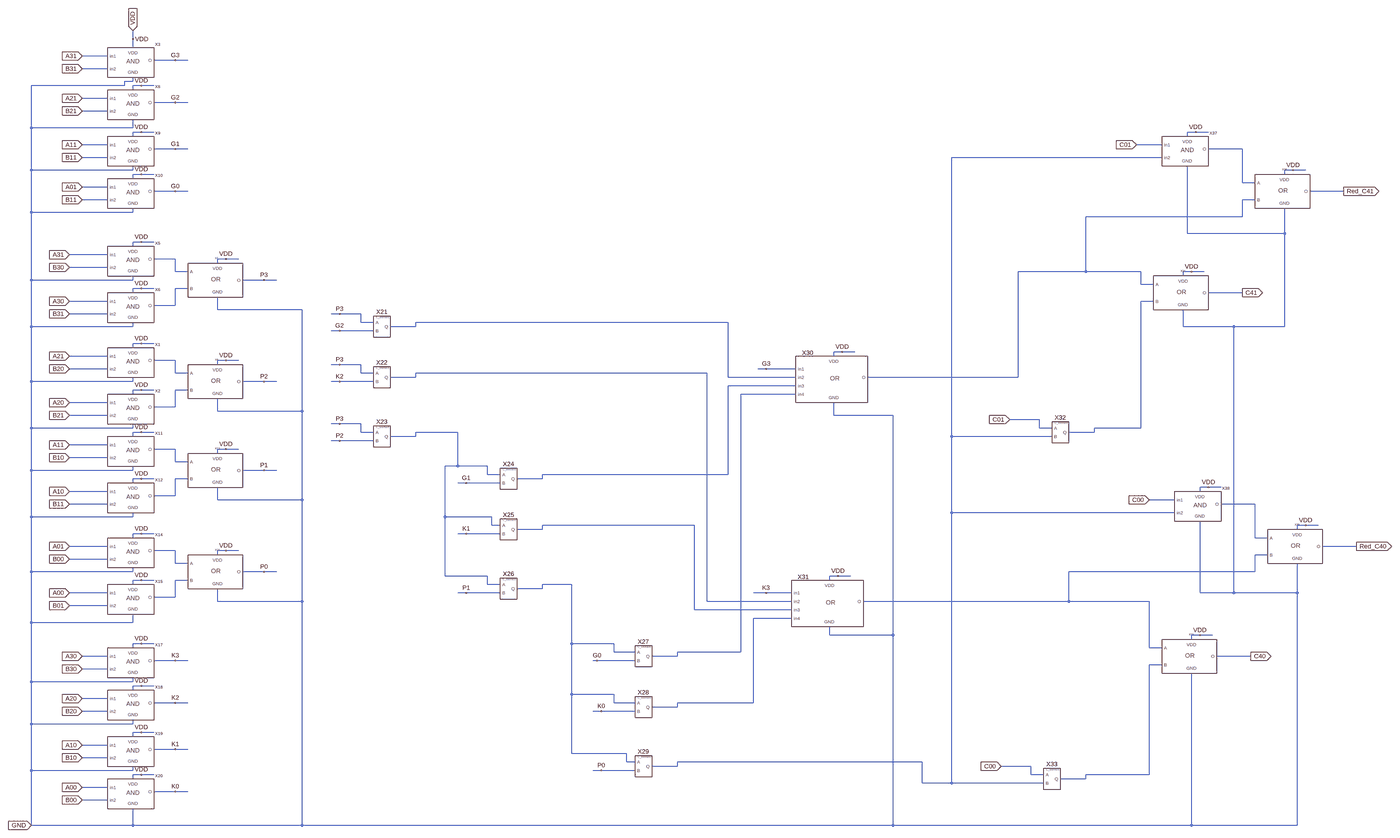
[diagram p0: schematic asy_CLA_4bit.asc, whole sheet]
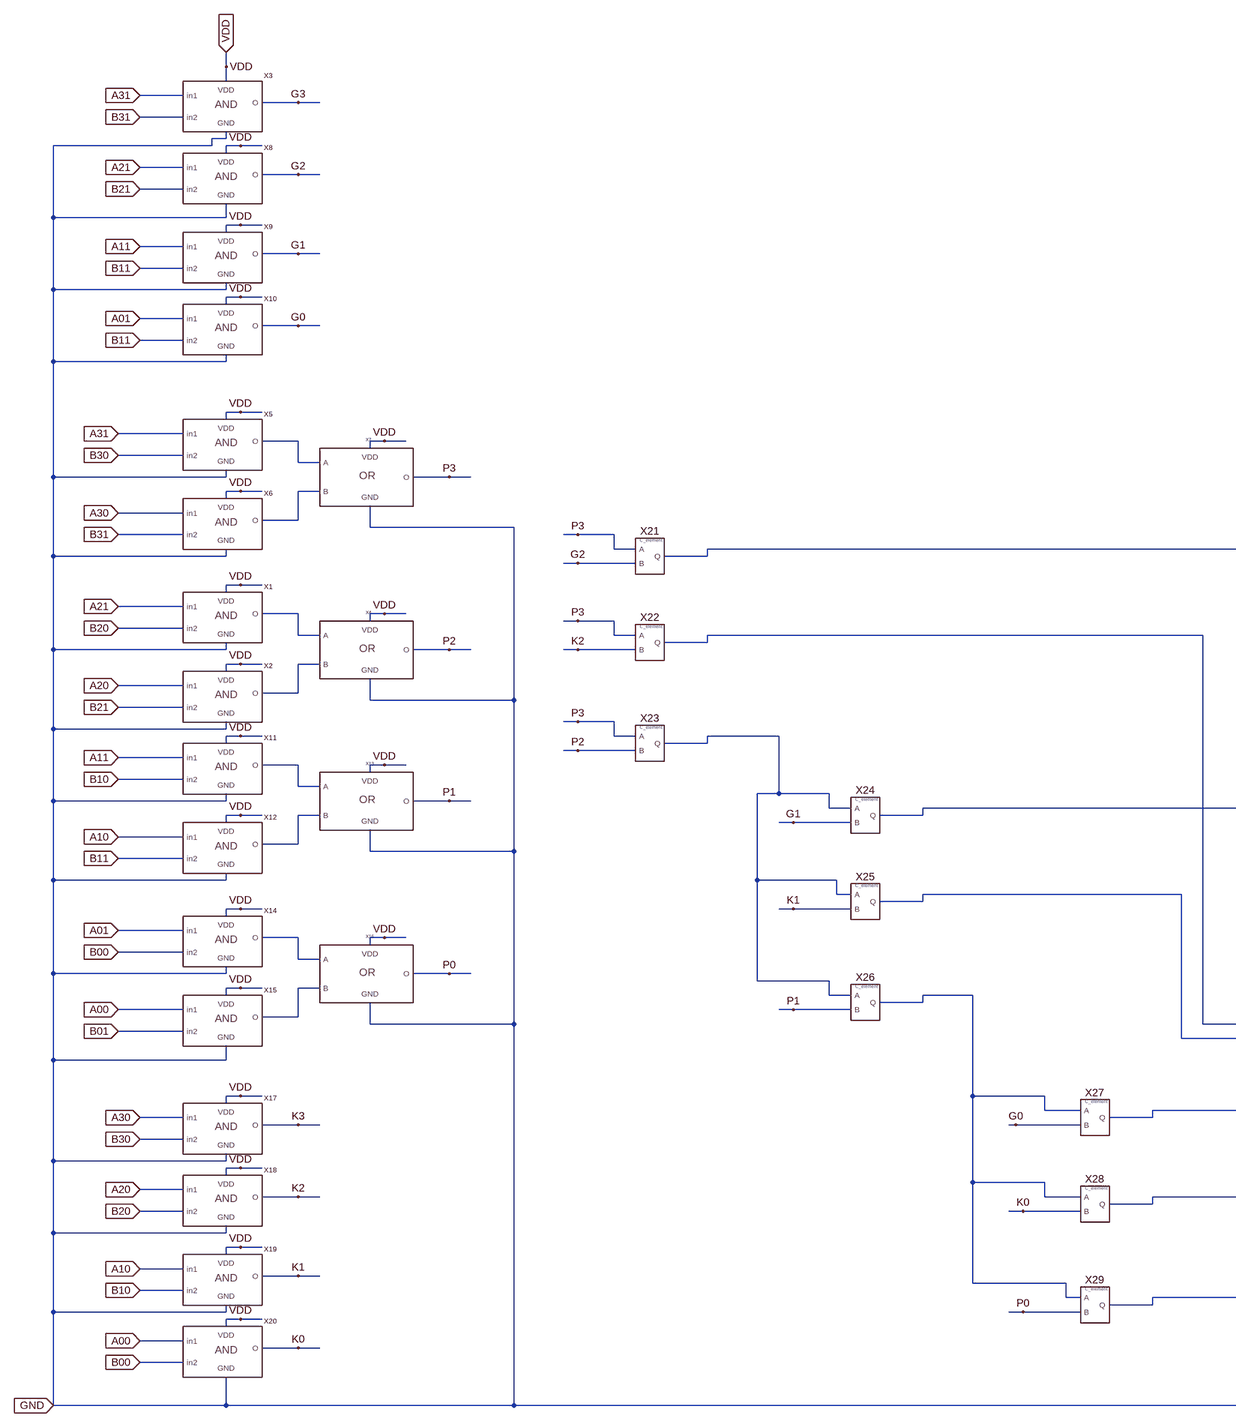
[diagram p1: schematic asy_CLA_4bit.asc, part, row 1 of 1, column 1 of 2]
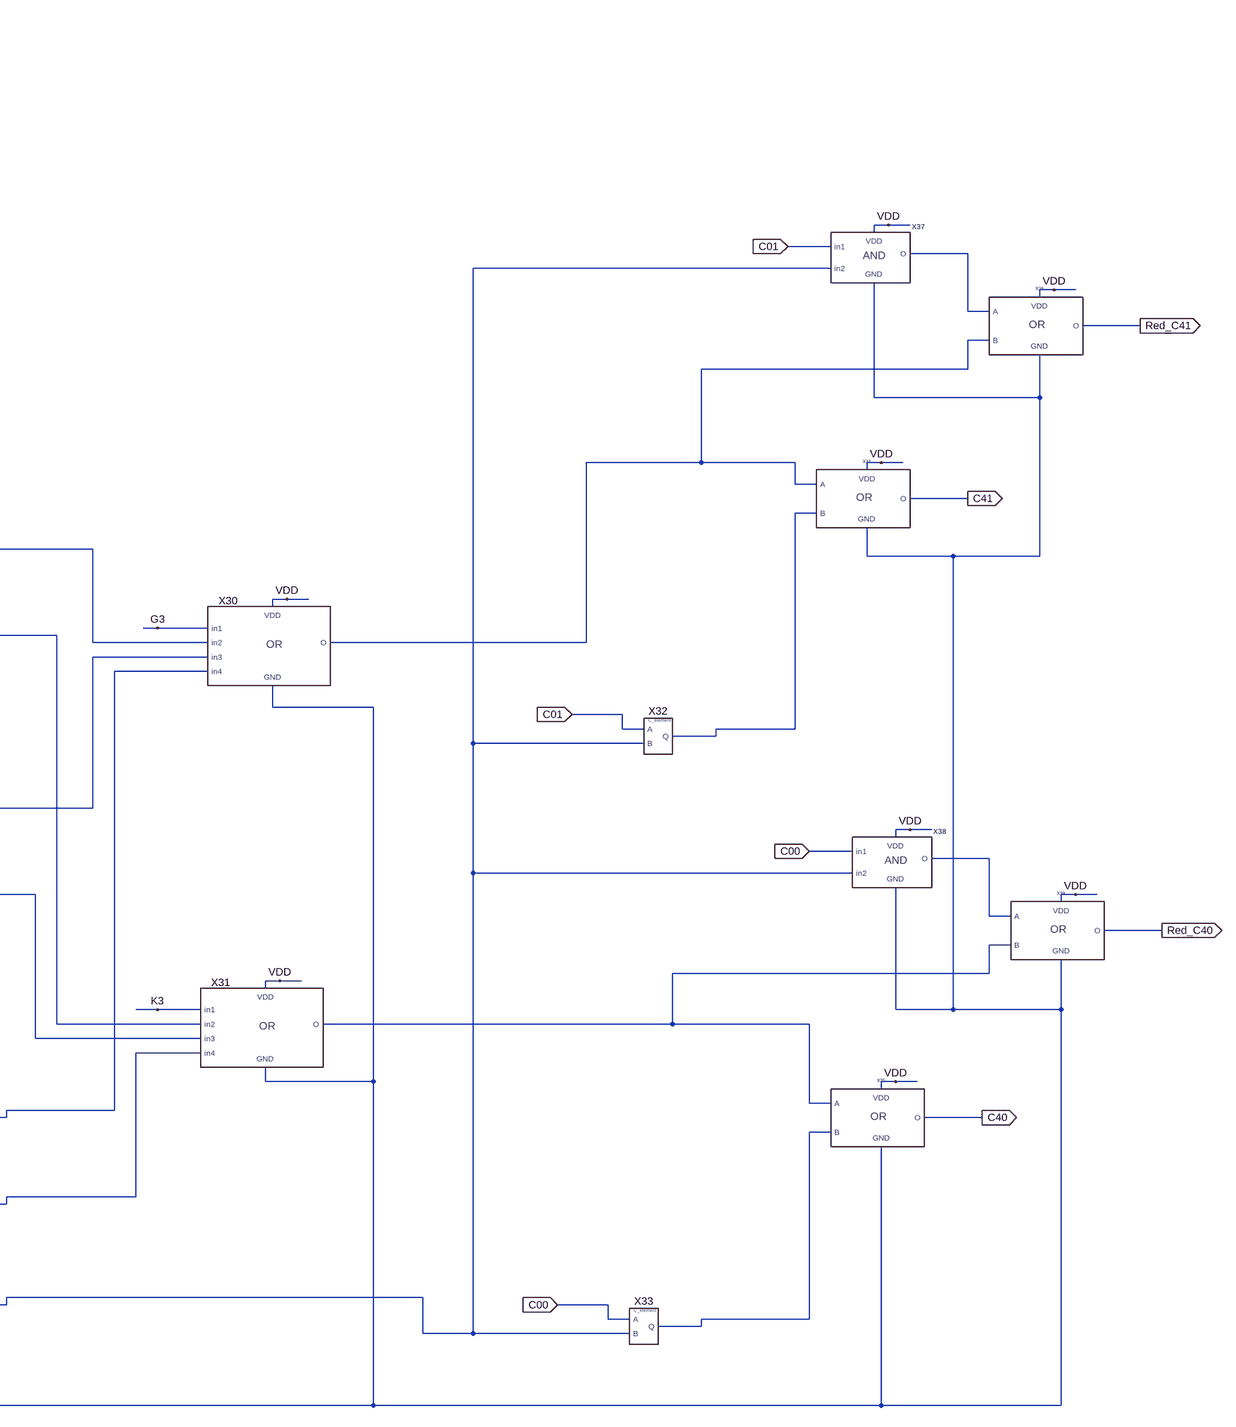
[diagram p2: schematic asy_CLA_4bit.asc, part, row 1 of 1, column 2 of 2]
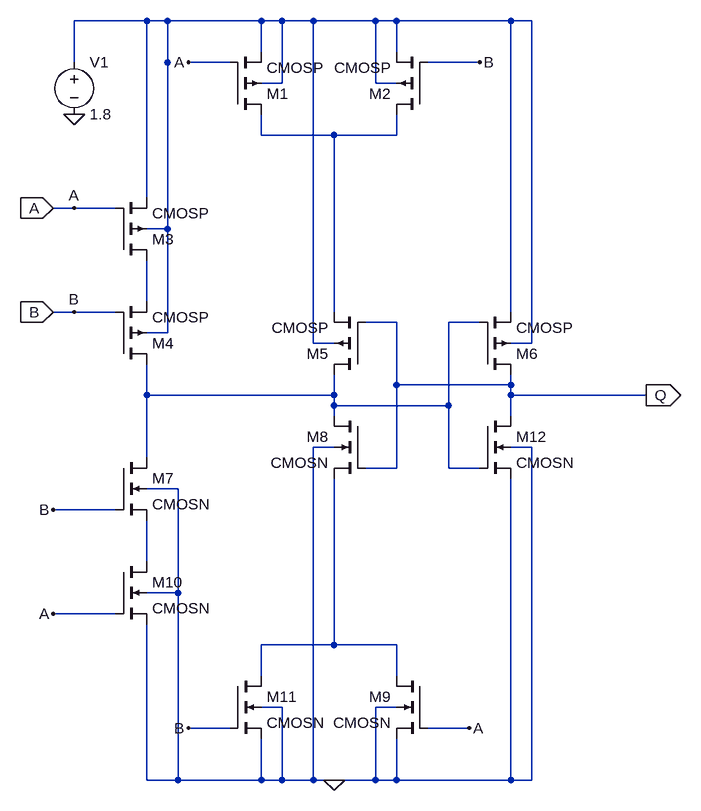
[diagram p3: sub-circuit muller_c_sutherland.asc]
asy_CLA_4bit.asc, the LTspice schematic file:
Version 4
SHEET 1 6692 2840
WIRE 80 -208 80 -240
WIRE 80 -176 80 -208
WIRE -16 -144 -112 -144
WIRE 240 -128 160 -128
WIRE 288 -128 240 -128
WIRE -16 -96 -112 -96
WIRE 80 -48 80 -64
WIRE 80 -48 48 -48
WIRE 48 -32 48 -48
WIRE 48 -32 -304 -32
WIRE 112 -32 80 -32
WIRE 160 -32 112 -32
WIRE 80 -16 80 -32
WIRE -16 16 -112 16
WIRE 240 32 160 32
WIRE 288 32 240 32
WIRE -16 64 -112 64
WIRE -304 128 -304 -32
WIRE 80 128 80 96
WIRE 80 128 -304 128
WIRE 112 144 80 144
WIRE 160 144 112 144
WIRE 5216 144 5184 144
WIRE 5264 144 5216 144
WIRE 80 160 80 144
WIRE 5184 160 5184 144
WIRE -16 192 -112 192
WIRE 5088 192 4992 192
WIRE 240 208 160 208
WIRE 288 208 240 208
WIRE 5392 208 5264 208
WIRE -16 240 -112 240
WIRE 5088 240 4256 240
WIRE -304 288 -304 128
WIRE 80 288 80 272
WIRE 80 288 -304 288
WIRE 5584 288 5552 288
WIRE 5632 288 5584 288
WIRE 112 304 80 304
WIRE 160 304 112 304
WIRE 5552 304 5552 288
WIRE 80 320 80 304
WIRE 5392 336 5392 208
WIRE 5440 336 5392 336
WIRE -16 352 -112 352
WIRE 240 368 160 368
WIRE 288 368 240 368
WIRE 5776 368 5648 368
WIRE -16 400 -112 400
WIRE 5440 400 5392 400
WIRE -304 448 -304 288
WIRE 80 448 80 432
WIRE 80 448 -304 448
WIRE 5392 464 5392 400
WIRE 5392 464 4800 464
WIRE 5184 528 5184 272
WIRE 5552 528 5552 432
WIRE 5552 528 5184 528
WIRE 112 560 80 560
WIRE 160 560 112 560
WIRE 80 576 80 560
WIRE -16 608 -160 608
WIRE 240 624 160 624
WIRE 432 624 400 624
WIRE 480 624 432 624
WIRE 400 640 400 624
WIRE -16 656 -160 656
WIRE 240 672 240 624
WIRE 288 672 240 672
WIRE 4800 672 4800 464
WIRE 4800 672 4544 672
WIRE 5008 672 4800 672
WIRE 5200 672 5168 672
WIRE 5248 672 5200 672
WIRE 5168 688 5168 672
WIRE -304 704 -304 448
WIRE 80 704 80 688
WIRE 80 704 -304 704
WIRE 576 704 496 704
WIRE 624 704 576 704
WIRE 5008 720 5008 672
WIRE 5056 720 5008 720
WIRE 112 736 80 736
WIRE 160 736 112 736
WIRE 288 736 240 736
WIRE 80 752 80 736
WIRE 5392 752 5264 752
WIRE -16 784 -160 784
WIRE 5056 784 5008 784
WIRE 240 800 240 736
WIRE 240 800 160 800
WIRE 400 816 400 768
WIRE 720 816 400 816
WIRE -16 832 -160 832
WIRE 1072 832 1040 832
WIRE 1152 832 1072 832
WIRE 1152 864 1152 832
WIRE 1200 864 1152 864
WIRE 3040 864 1360 864
WIRE -304 880 -304 704
WIRE 80 880 80 864
WIRE 80 880 -304 880
WIRE 1360 880 1360 864
WIRE 1360 880 1264 880
WIRE 5168 880 5168 816
WIRE 5360 880 5168 880
WIRE 5552 880 5552 528
WIRE 5552 880 5360 880
WIRE 1072 896 1040 896
WIRE 1200 896 1072 896
WIRE 112 944 80 944
WIRE 160 944 112 944
WIRE 80 960 80 944
WIRE 3472 976 3440 976
WIRE 3520 976 3472 976
WIRE -16 992 -160 992
WIRE 3440 992 3440 976
WIRE 240 1008 160 1008
WIRE 432 1008 400 1008
WIRE 480 1008 432 1008
WIRE 400 1024 400 1008
WIRE 1072 1024 1040 1024
WIRE 1152 1024 1072 1024
WIRE -16 1040 -160 1040
WIRE 3184 1040 3152 1040
WIRE 3296 1040 3184 1040
WIRE 240 1056 240 1008
WIRE 288 1056 240 1056
WIRE 1152 1056 1152 1024
WIRE 1200 1056 1152 1056
WIRE 2960 1056 1360 1056
WIRE 1360 1072 1360 1056
WIRE 1360 1072 1264 1072
WIRE 3040 1072 3040 864
WIRE 3296 1072 3040 1072
WIRE 4544 1072 4544 672
WIRE 4544 1072 3568 1072
WIRE -304 1088 -304 880
WIRE 80 1088 80 1072
WIRE 80 1088 -304 1088
WIRE 576 1088 496 1088
WIRE 624 1088 576 1088
WIRE 1072 1088 1040 1088
WIRE 1200 1088 1072 1088
WIRE 3296 1104 3040 1104
WIRE 112 1120 80 1120
WIRE 160 1120 112 1120
WIRE 288 1120 240 1120
WIRE 80 1136 80 1120
WIRE 3296 1136 3088 1136
WIRE -16 1168 -160 1168
WIRE 240 1184 240 1120
WIRE 240 1184 160 1184
WIRE 400 1200 400 1152
WIRE 720 1200 720 816
WIRE 720 1200 400 1200
WIRE -16 1216 -160 1216
WIRE 3440 1216 3440 1168
WIRE 3664 1216 3440 1216
WIRE 4624 1232 4512 1232
WIRE 1072 1248 1040 1248
WIRE 1152 1248 1072 1248
WIRE -304 1264 -304 1088
WIRE 80 1264 80 1248
WIRE 80 1264 -304 1264
WIRE 4624 1264 4624 1232
WIRE 4672 1264 4624 1264
WIRE 5008 1264 5008 784
WIRE 5008 1264 4832 1264
WIRE 112 1280 80 1280
WIRE 160 1280 112 1280
WIRE 1152 1280 1152 1248
WIRE 1200 1280 1152 1280
WIRE 1744 1280 1360 1280
WIRE 4832 1280 4832 1264
WIRE 4832 1280 4736 1280
WIRE 80 1296 80 1280
WIRE 1360 1296 1360 1280
WIRE 1360 1296 1264 1296
WIRE 4256 1296 4256 240
WIRE 4672 1296 4256 1296
WIRE 1072 1312 1040 1312
WIRE 1200 1312 1072 1312
WIRE -16 1328 -160 1328
WIRE 240 1344 160 1344
WIRE 432 1344 400 1344
WIRE 480 1344 432 1344
WIRE 400 1360 400 1344
WIRE -16 1376 -160 1376
WIRE 240 1392 240 1344
WIRE 288 1392 240 1392
WIRE 1744 1408 1744 1280
WIRE 1744 1408 1696 1408
WIRE 1856 1408 1744 1408
WIRE -304 1424 -304 1264
WIRE 80 1424 80 1408
WIRE 80 1424 -304 1424
WIRE 576 1424 496 1424
WIRE 624 1424 576 1424
WIRE 1856 1440 1856 1408
WIRE 1904 1440 1856 1440
WIRE 3040 1440 3040 1104
WIRE 3040 1440 2064 1440
WIRE 112 1456 80 1456
WIRE 160 1456 112 1456
WIRE 288 1456 240 1456
WIRE 2064 1456 2064 1440
WIRE 2064 1456 1968 1456
WIRE 80 1472 80 1456
WIRE 1776 1472 1744 1472
WIRE 1904 1472 1776 1472
WIRE 5264 1488 5232 1488
WIRE 5312 1488 5264 1488
WIRE -16 1504 -160 1504
WIRE 5232 1504 5232 1488
WIRE 240 1520 240 1456
WIRE 240 1520 160 1520
WIRE 400 1536 400 1488
WIRE 720 1536 720 1200
WIRE 720 1536 400 1536
WIRE 5136 1536 5040 1536
WIRE -16 1552 -160 1552
WIRE 5440 1552 5312 1552
WIRE 4256 1584 4256 1296
WIRE 5136 1584 4256 1584
WIRE -304 1600 -304 1424
WIRE 80 1600 80 1584
WIRE 80 1600 -304 1600
WIRE 1696 1600 1696 1408
WIRE 1872 1600 1696 1600
WIRE 1872 1632 1872 1600
WIRE 1904 1632 1872 1632
WIRE 2912 1632 2064 1632
WIRE 5632 1632 5600 1632
WIRE 5680 1632 5632 1632
WIRE 2064 1648 2064 1632
WIRE 2064 1648 1968 1648
WIRE 5600 1648 5600 1632
WIRE 112 1664 80 1664
WIRE 160 1664 112 1664
WIRE 1776 1664 1744 1664
WIRE 1904 1664 1776 1664
WIRE 80 1680 80 1664
WIRE 5440 1680 5440 1552
WIRE 5488 1680 5440 1680
WIRE -16 1712 -160 1712
WIRE 5824 1712 5696 1712
WIRE 240 1728 160 1728
WIRE 432 1728 400 1728
WIRE 480 1728 432 1728
WIRE 400 1744 400 1728
WIRE 5488 1744 5440 1744
WIRE -16 1760 -160 1760
WIRE 240 1776 240 1728
WIRE 288 1776 240 1776
WIRE -304 1808 -304 1600
WIRE 80 1808 80 1792
WIRE 80 1808 -304 1808
WIRE 576 1808 496 1808
WIRE 624 1808 576 1808
WIRE 5440 1808 5440 1744
WIRE 5440 1808 4736 1808
WIRE 1696 1824 1696 1600
WIRE 1856 1824 1696 1824
WIRE 3456 1824 3424 1824
WIRE 3504 1824 3456 1824
WIRE 112 1840 80 1840
WIRE 160 1840 112 1840
WIRE 288 1840 240 1840
WIRE 3424 1840 3424 1824
WIRE 80 1856 80 1840
WIRE 1856 1856 1856 1824
WIRE 1904 1856 1856 1856
WIRE 2448 1856 2064 1856
WIRE 2064 1872 2064 1856
WIRE 2064 1872 1968 1872
WIRE -16 1888 -160 1888
WIRE 1776 1888 1744 1888
WIRE 1904 1888 1776 1888
WIRE 3184 1888 3136 1888
WIRE 3280 1888 3184 1888
WIRE 5232 1888 5232 1616
WIRE 5360 1888 5360 880
WIRE 5360 1888 5232 1888
WIRE 5600 1888 5600 1776
WIRE 5600 1888 5360 1888
WIRE 240 1904 240 1840
WIRE 240 1904 160 1904
WIRE 400 1920 400 1872
WIRE 720 1920 720 1536
WIRE 720 1920 400 1920
WIRE 2960 1920 2960 1056
WIRE 3280 1920 2960 1920
WIRE 4736 1920 4736 1808
WIRE 4736 1920 3552 1920
WIRE 5040 1920 4736 1920
WIRE -16 1936 -160 1936
WIRE 2912 1952 2912 1632
WIRE 3280 1952 2912 1952
WIRE 3280 1984 3136 1984
WIRE -304 2000 -304 1808
WIRE 80 2000 80 1968
WIRE 80 2000 -304 2000
WIRE 3424 2048 3424 2016
WIRE 3664 2048 3664 1216
WIRE 3664 2048 3424 2048
WIRE 5232 2048 5200 2048
WIRE 5280 2048 5232 2048
WIRE 5200 2064 5200 2048
WIRE 112 2080 80 2080
WIRE 160 2080 112 2080
WIRE 2448 2080 2448 1856
WIRE 2608 2080 2448 2080
WIRE 80 2096 80 2080
WIRE 5040 2096 5040 1920
WIRE 5088 2096 5040 2096
WIRE 2608 2112 2608 2080
WIRE 2688 2112 2608 2112
WIRE 3088 2112 3088 1136
WIRE 3088 2112 2848 2112
WIRE -16 2128 -112 2128
WIRE 2848 2128 2848 2112
WIRE 2848 2128 2752 2128
WIRE 5424 2128 5296 2128
WIRE 240 2144 160 2144
WIRE 288 2144 240 2144
WIRE 2544 2144 2528 2144
WIRE 2688 2144 2544 2144
WIRE 5088 2160 5040 2160
WIRE -16 2176 -112 2176
WIRE -304 2224 -304 2000
WIRE 80 2224 80 2208
WIRE 80 2224 -304 2224
WIRE 112 2240 80 2240
WIRE 160 2240 112 2240
WIRE 80 2256 80 2240
WIRE 2448 2272 2448 2080
WIRE 2608 2272 2448 2272
WIRE -16 2288 -112 2288
WIRE 240 2304 160 2304
WIRE 288 2304 240 2304
WIRE 2608 2304 2608 2272
WIRE 2688 2304 2608 2304
WIRE 3136 2304 3136 1984
WIRE 3136 2304 2848 2304
WIRE 2848 2320 2848 2304
WIRE 2848 2320 2752 2320
WIRE -16 2336 -112 2336
WIRE 2560 2336 2528 2336
WIRE 2688 2336 2560 2336
WIRE -304 2384 -304 2224
WIRE 80 2384 80 2368
WIRE 80 2384 -304 2384
WIRE 112 2416 80 2416
WIRE 160 2416 112 2416
WIRE 80 2432 80 2416
WIRE -16 2464 -112 2464
WIRE 240 2480 160 2480
WIRE 288 2480 240 2480
WIRE 2448 2496 2448 2272
WIRE 2656 2496 2448 2496
WIRE -16 2512 -112 2512
WIRE 2656 2528 2656 2496
WIRE 2688 2528 2656 2528
WIRE 4096 2528 2848 2528
WIRE 2848 2544 2848 2528
WIRE 2848 2544 2752 2544
WIRE 4592 2544 4480 2544
WIRE -304 2560 -304 2384
WIRE 80 2560 80 2544
WIRE 80 2560 -304 2560
WIRE 2560 2560 2528 2560
WIRE 2688 2560 2560 2560
WIRE 112 2576 80 2576
WIRE 160 2576 112 2576
WIRE 4592 2576 4592 2544
WIRE 4640 2576 4592 2576
WIRE 5040 2576 5040 2160
WIRE 5040 2576 4800 2576
WIRE 80 2592 80 2576
WIRE 4800 2592 4800 2576
WIRE 4800 2592 4704 2592
WIRE 4096 2608 4096 2528
WIRE 4256 2608 4256 1584
WIRE 4256 2608 4096 2608
WIRE 4640 2608 4256 2608
WIRE -16 2624 -112 2624
WIRE 240 2640 160 2640
WIRE 288 2640 240 2640
WIRE -16 2672 -112 2672
WIRE -304 2768 -304 2560
WIRE 80 2768 80 2704
WIRE 80 2768 -304 2768
WIRE 720 2768 720 1920
WIRE 720 2768 80 2768
WIRE 3664 2768 3664 2048
WIRE 3664 2768 720 2768
WIRE 5200 2768 5200 2192
WIRE 5200 2768 3664 2768
WIRE 5600 2768 5600 1888
WIRE 5600 2768 5200 2768
FLAG 240 -128 G3
FLAG 240 32 G2
FLAG 240 208 G1
FLAG 240 368 G0
FLAG 576 704 P3
FLAG 576 1088 P2
FLAG 576 1424 P1
FLAG 576 1808 P0
FLAG 240 2144 K3
FLAG 240 2304 K2
FLAG 240 2480 K1
FLAG 240 2640 K0
FLAG -112 -144 A31
IOPIN -112 -144 In
FLAG -112 16 A21
IOPIN -112 16 In
FLAG -112 192 A11
IOPIN -112 192 In
FLAG -112 352 A01
IOPIN -112 352 In
FLAG -160 608 A31
IOPIN -160 608 In
FLAG -160 784 A30
IOPIN -160 784 In
FLAG -160 992 A21
IOPIN -160 992 In
FLAG -160 1168 A20
IOPIN -160 1168 In
FLAG -160 1328 A11
IOPIN -160 1328 In
FLAG -160 1504 A10
IOPIN -160 1504 In
FLAG -160 1712 A01
IOPIN -160 1712 In
FLAG -160 1888 A00
IOPIN -160 1888 In
FLAG -112 2128 A30
IOPIN -112 2128 In
FLAG -112 2288 A20
IOPIN -112 2288 In
FLAG -112 2464 A10
IOPIN -112 2464 In
FLAG -112 2624 A00
IOPIN -112 2624 In
FLAG -112 -96 B31
IOPIN -112 -96 In
FLAG -112 64 B21
IOPIN -112 64 In
FLAG -112 240 B11
IOPIN -112 240 In
FLAG -112 400 B11
IOPIN -112 400 In
FLAG -160 656 B30
IOPIN -160 656 In
FLAG -160 832 B31
IOPIN -160 832 In
FLAG -160 1040 B20
IOPIN -160 1040 In
FLAG -160 1216 B21
IOPIN -160 1216 In
FLAG -160 1376 B10
IOPIN -160 1376 In
FLAG -160 1552 B11
IOPIN -160 1552 In
FLAG -160 1936 B01
IOPIN -160 1936 In
FLAG -160 1760 B00
IOPIN -160 1760 In
FLAG -112 2176 B30
IOPIN -112 2176 In
FLAG -112 2336 B20
IOPIN -112 2336 In
FLAG -112 2512 B10
IOPIN -112 2512 In
FLAG -112 2672 B00
IOPIN -112 2672 In
FLAG 2544 2144 G0
FLAG 1776 1472 G1
FLAG 1072 896 G2
FLAG 3184 1040 G3
FLAG 3184 1888 K3
FLAG 1072 832 P3
FLAG 1072 1024 P3
FLAG 1072 1248 P3
FLAG 1072 1312 P2
FLAG 1776 1888 P1
FLAG 2560 2560 P0
FLAG 1072 1088 K2
FLAG 1776 1664 K1
FLAG 2560 2336 K0
FLAG 4480 2544 C00
IOPIN 4480 2544 In
FLAG 5040 1536 C00
IOPIN 5040 1536 In
FLAG 4512 1232 C01
IOPIN 4512 1232 In
FLAG 4992 192 C01
IOPIN 4992 192 In
FLAG 5824 1712 Red_C40
IOPIN 5824 1712 Out
FLAG 5392 752 C41
IOPIN 5392 752 Out
FLAG 5776 368 Red_C41
IOPIN 5776 368 Out
FLAG 5424 2128 C40
IOPIN 5424 2128 Out
FLAG 80 -208 VDD
FLAG 112 -32 VDD
FLAG 112 144 VDD
FLAG 112 304 VDD
FLAG 112 560 VDD
FLAG 112 736 VDD
FLAG 432 624 VDD
FLAG 112 944 VDD
FLAG 432 1008 VDD
FLAG 112 1120 VDD
FLAG 112 1280 VDD
FLAG 432 1344 VDD
FLAG 112 1456 VDD
FLAG 112 1664 VDD
FLAG 112 1840 VDD
FLAG 432 1728 VDD
FLAG 112 2080 VDD
FLAG 112 2576 VDD
FLAG 112 2416 VDD
FLAG 112 2240 VDD
FLAG 3472 976 VDD
FLAG 3456 1824 VDD
FLAG 5232 2048 VDD
FLAG 5632 1632 VDD
FLAG 5264 1488 VDD
FLAG 5216 144 VDD
FLAG 5200 672 VDD
FLAG 5584 288 VDD
FLAG 80 -240 VDD
IOPIN 80 -240 In
FLAG -304 2768 GND
IOPIN -304 2768 In
SYMBOL AND 48 -128 R0
SYMATTR InstName X3
SYMBOL AND 48 624 R0
SYMATTR InstName X5
SYMBOL AND 48 800 R0
SYMATTR InstName X6
SYMBOL or 384 704 R0
SYMATTR InstName X7
SYMBOL AND 48 1008 R0
SYMATTR InstName X1
SYMBOL AND 48 1184 R0
SYMATTR InstName X2
SYMBOL or 384 1088 R0
SYMATTR InstName X4
SYMBOL AND 48 32 R0
SYMATTR InstName X8
SYMBOL AND 48 208 R0
SYMATTR InstName X9
SYMBOL AND 48 368 R0
SYMATTR InstName X10
SYMBOL AND 48 1344 R0
SYMATTR InstName X11
SYMBOL AND 48 1520 R0
SYMATTR InstName X12
SYMBOL or 384 1424 R0
SYMATTR InstName X13
SYMBOL AND 48 1728 R0
SYMATTR InstName X14
SYMBOL AND 48 1904 R0
SYMATTR InstName X15
SYMBOL or 384 1808 R0
SYMATTR InstName X16
SYMBOL AND 48 2144 R0
SYMATTR InstName X17
SYMBOL AND 48 2304 R0
SYMATTR InstName X18
SYMBOL AND 48 2480 R0
SYMATTR InstName X19
SYMBOL AND 48 2640 R0
SYMATTR InstName X20
SYMBOL Muller_c_sutherland 1232 880 R0
SYMATTR InstName X21
SYMBOL Muller_c_sutherland 1232 1072 R0
SYMATTR InstName X22
SYMBOL Muller_c_sutherland 1232 1296 R0
SYMATTR InstName X23
SYMBOL Muller_c_sutherland 1936 1456 R0
SYMATTR InstName X24
SYMBOL Muller_c_sutherland 1936 1648 R0
SYMATTR InstName X25
SYMBOL Muller_c_sutherland 1936 1872 R0
SYMATTR InstName X26
SYMBOL Muller_c_sutherland 2720 2128 R0
SYMATTR InstName X27
SYMBOL Muller_c_sutherland 2720 2320 R0
SYMATTR InstName X28
SYMBOL Muller_c_sutherland 2720 2544 R0
SYMATTR InstName X29
SYMBOL or_4_ip 3392 1936 R0
SYMATTR InstName X31
SYMBOL or_4_ip 3408 1088 R0
SYMATTR InstName X30
SYMBOL Muller_c_sutherland 4704 1280 R0
SYMATTR InstName X32
SYMBOL Muller_c_sutherland 4672 2592 R0
SYMATTR InstName X33
SYMBOL or 5152 752 R0
SYMATTR InstName X34
SYMBOL or 5184 2128 R0
SYMATTR InstName X35
SYMBOL AND 5152 208 R0
SYMATTR InstName X37
SYMBOL or 5536 368 R0
SYMATTR InstName X36
SYMBOL AND 5200 1552 R0
SYMATTR InstName X38
SYMBOL or 5584 1712 R0
SYMATTR InstName X39

muller_c_sutherland.asc, the sub-circuit schematic file:
Version 4
SHEET 1 880 1236
WIRE -32 -64 -144 -64
WIRE 0 -64 -32 -64
WIRE 144 -64 0 -64
WIRE 176 -64 144 -64
WIRE 224 -64 176 -64
WIRE 320 -64 224 -64
WIRE 352 -64 320 -64
WIRE 528 -64 352 -64
WIRE 560 -64 528 -64
WIRE 144 -16 144 -64
WIRE 352 -16 352 -64
WIRE -144 0 -144 -64
WIRE 96 0 32 0
WIRE 480 0 400 0
WIRE 176 32 176 -64
WIRE 176 32 144 32
WIRE 320 32 320 -64
WIRE 352 32 320 32
WIRE 144 112 144 80
WIRE 256 112 144 112
WIRE 352 112 352 80
WIRE 352 112 256 112
WIRE -32 208 -32 -64
WIRE -144 224 -176 224
WIRE -80 224 -144 224
WIRE 0 256 0 -64
WIRE 0 256 -32 256
WIRE -32 368 -32 304
WIRE -144 384 -176 384
WIRE -80 384 -144 384
WIRE 256 384 256 112
WIRE 528 384 528 -64
WIRE 352 400 304 400
WIRE 480 400 432 400
WIRE 0 416 0 256
WIRE 0 416 -32 416
WIRE 224 432 224 -64
WIRE 256 432 224 432
WIRE 560 432 560 -64
WIRE 560 432 528 432
WIRE 352 496 352 400
WIRE 528 496 528 480
WIRE 528 496 352 496
WIRE -32 512 -32 464
WIRE 256 512 256 480
WIRE 256 512 -32 512
WIRE 528 512 528 496
WIRE 736 512 528 512
WIRE 256 528 256 512
WIRE 432 528 432 400
WIRE 432 528 256 528
WIRE 256 544 256 528
WIRE 528 544 528 512
WIRE 256 592 224 592
WIRE 560 592 528 592
WIRE -32 608 -32 512
WIRE 352 624 352 496
WIRE 352 624 304 624
WIRE 432 624 432 528
WIRE 480 624 432 624
WIRE 16 656 -32 656
WIRE -80 688 -176 688
WIRE -32 768 -32 704
WIRE 16 816 16 656
WIRE 16 816 -32 816
WIRE -80 848 -176 848
WIRE 256 896 256 640
WIRE 256 896 144 896
WIRE 352 896 256 896
WIRE 144 944 144 896
WIRE 352 944 352 896
WIRE 176 992 144 992
WIRE 352 992 320 992
WIRE 96 1024 32 1024
WIRE 464 1024 400 1024
WIRE -32 1104 -32 864
WIRE 16 1104 16 816
WIRE 16 1104 -32 1104
WIRE 144 1104 144 1040
WIRE 144 1104 16 1104
WIRE 176 1104 176 992
WIRE 176 1104 144 1104
WIRE 224 1104 224 592
WIRE 224 1104 176 1104
WIRE 256 1104 224 1104
WIRE 320 1104 320 992
WIRE 320 1104 256 1104
WIRE 352 1104 352 1040
WIRE 352 1104 320 1104
WIRE 528 1104 528 640
WIRE 528 1104 352 1104
WIRE 560 1104 560 592
WIRE 560 1104 528 1104
WIRE 0 0 0 0
FLAG 736 512 Q
IOPIN 736 512 Out
FLAG -176 224 A
IOPIN -176 224 In
FLAG -176 384 B
IOPIN -176 384 In
FLAG 32 0 A
FLAG 480 0 B
FLAG -176 688 B
FLAG -176 848 A
FLAG 32 1024 B
FLAG 464 1024 A
FLAG 256 1104 0
FLAG -144 80 0
FLAG -144 224 A
FLAG -144 384 B
SYMBOL pmos4 96 80 M180
SYMATTR InstName M1
SYMATTR Value CMOSP
SYMATTR Value2 l=180n w=440n
SYMBOL pmos4 400 80 R180
SYMATTR InstName M2
SYMATTR Value CMOSP
SYMATTR Value2 l=180n w=440n
SYMBOL pmos4 -80 304 M180
SYMATTR InstName M3
SYMATTR Value CMOSP
SYMATTR Value2 l=180n w=440n
SYMBOL pmos4 -80 464 M180
SYMATTR InstName M4
SYMATTR Value CMOSP
SYMATTR Value2 l=180n w=440n
SYMBOL pmos4 304 480 R180
SYMATTR InstName M5
SYMATTR Value CMOSP
SYMATTR Value2 l=180n w=440n
SYMBOL pmos4 480 480 M180
SYMATTR InstName M6
SYMATTR Value CMOSP
SYMATTR Value2 l=180n w=440n
SYMBOL nmos4 -80 608 R0
SYMATTR InstName M7
SYMATTR Value CMOSN
SYMATTR Value2 l=180n w=220n
SYMBOL nmos4 304 544 M0
SYMATTR InstName M8
SYMATTR Value CMOSN
SYMATTR Value2 l=180n w=220n
SYMBOL nmos4 400 944 M0
SYMATTR InstName M9
SYMATTR Value CMOSN
SYMATTR Value2 l=180n w=220n
SYMBOL nmos4 -80 768 R0
SYMATTR InstName M10
SYMATTR Value CMOSN
SYMATTR Value2 l=180n w=220n
SYMBOL nmos4 96 944 R0
SYMATTR InstName M11
SYMATTR Value CMOSN
SYMATTR Value2 l=180n w=220n
SYMBOL nmos4 480 544 R0
SYMATTR InstName M12
SYMATTR Value CMOSN
SYMATTR Value2 l=180n w=220n
SYMBOL voltage -144 -16 R0
WINDOW 123 0 0 Left 0
WINDOW 39 0 0 Left 0
SYMATTR InstName V1
SYMATTR Value 1.8

The netlist it stands for:
* asy_CLA_4bit.asc
XX3 A31 B31 VDD GND G3 AND  ; pins in1 in2 VDD GND O
XX5 A31 B30 VDD GND N004 AND  ; pins in1 in2 VDD GND O
XX6 A30 B31 VDD GND N005 AND  ; pins in1 in2 VDD GND O
XX7 N004 N005 VDD GND P3 or  ; pins A B VDD GND O
XX1 A21 B20 VDD GND N008 AND  ; pins in1 in2 VDD GND O
XX2 A20 B21 VDD GND N011 AND  ; pins in1 in2 VDD GND O
XX4 N008 N011 VDD GND P2 or  ; pins A B VDD GND O
XX8 A21 B21 VDD GND G2 AND  ; pins in1 in2 VDD GND O
XX9 A11 B11 VDD GND G1 AND  ; pins in1 in2 VDD GND O
XX10 A01 B11 VDD GND G0 AND  ; pins in1 in2 VDD GND O
XX11 A11 B10 VDD GND N014 AND  ; pins in1 in2 VDD GND O
XX12 A10 B11 VDD GND N015 AND  ; pins in1 in2 VDD GND O
XX13 N014 N015 VDD GND P1 or  ; pins A B VDD GND O
XX14 A01 B00 VDD GND N018 AND  ; pins in1 in2 VDD GND O
XX15 A00 B01 VDD GND N020 AND  ; pins in1 in2 VDD GND O
XX16 N018 N020 VDD GND P0 or  ; pins A B VDD GND O
XX17 A30 B30 VDD GND K3 AND  ; pins in1 in2 VDD GND O
XX18 A20 B20 VDD GND K2 AND  ; pins in1 in2 VDD GND O
XX19 A10 B10 VDD GND K1 AND  ; pins in1 in2 VDD GND O
XX20 A00 B00 VDD GND K0 AND  ; pins in1 in2 VDD GND O
XX21 P3 G2 N007 muller_c_sutherland
XX22 P3 K2 N009 muller_c_sutherland
XX23 P3 P2 N013 muller_c_sutherland
XX24 N013 G1 N010 muller_c_sutherland
XX25 N013 K1 N017 muller_c_sutherland
XX26 N013 P1 N021 muller_c_sutherland
XX27 N021 G0 N012 muller_c_sutherland
XX28 N021 K0 N022 muller_c_sutherland
XX29 N021 P0 N002 muller_c_sutherland
XX31 GND K3 N009 N017 N022 VDD N019 or_4_ip  ; pins GND in1 in2 in3 in4 VDD O
XX30 GND G3 N007 N010 N012 VDD N003 or_4_ip  ; pins GND in1 in2 in3 in4 VDD O
XX32 C01 N002 N006 muller_c_sutherland
XX33 C00 N002 N023 muller_c_sutherland
XX34 N003 N006 VDD GND C41 or  ; pins A B VDD GND O
XX35 N019 N023 VDD GND C40 or  ; pins A B VDD GND O
XX37 C01 N002 VDD GND N001 AND  ; pins in1 in2 VDD GND O
XX36 N001 N003 VDD GND Red_C41 or  ; pins A B VDD GND O
XX38 C00 N002 VDD GND N016 AND  ; pins in1 in2 VDD GND O
XX39 N016 N019 VDD GND Red_C40 or  ; pins A B VDD GND O

* block symbol definitions
.subckt muller_c_sutherland A B Q
M1 N002 A N001 N001 CMOSP l=180n w=440n
M2 N002 B N001 N001 CMOSP l=180n w=440n
M3 N003 A N001 N001 CMOSP l=180n w=440n
M4 N004 B N003 N001 CMOSP l=180n w=440n
M5 N004 Q N002 N001 CMOSP l=180n w=440n
M6 Q N004 N001 N001 CMOSP l=180n w=440n
M7 N004 B N005 0 CMOSN l=180n w=220n
M8 N004 Q N006 0 CMOSN l=180n w=220n
M9 N006 A 0 0 CMOSN l=180n w=220n
M10 N005 A 0 0 CMOSN l=180n w=220n
M11 N006 B 0 0 CMOSN l=180n w=220n
M12 Q N004 0 0 CMOSN l=180n w=220n
V1 N001 0 1.8
.ends muller_c_sutherland

.model NMOS NMOS
.model PMOS PMOS
.lib standard.mos
.backanno
.end